# EAGLE design TiltyDuo (EAGLE 6.4)
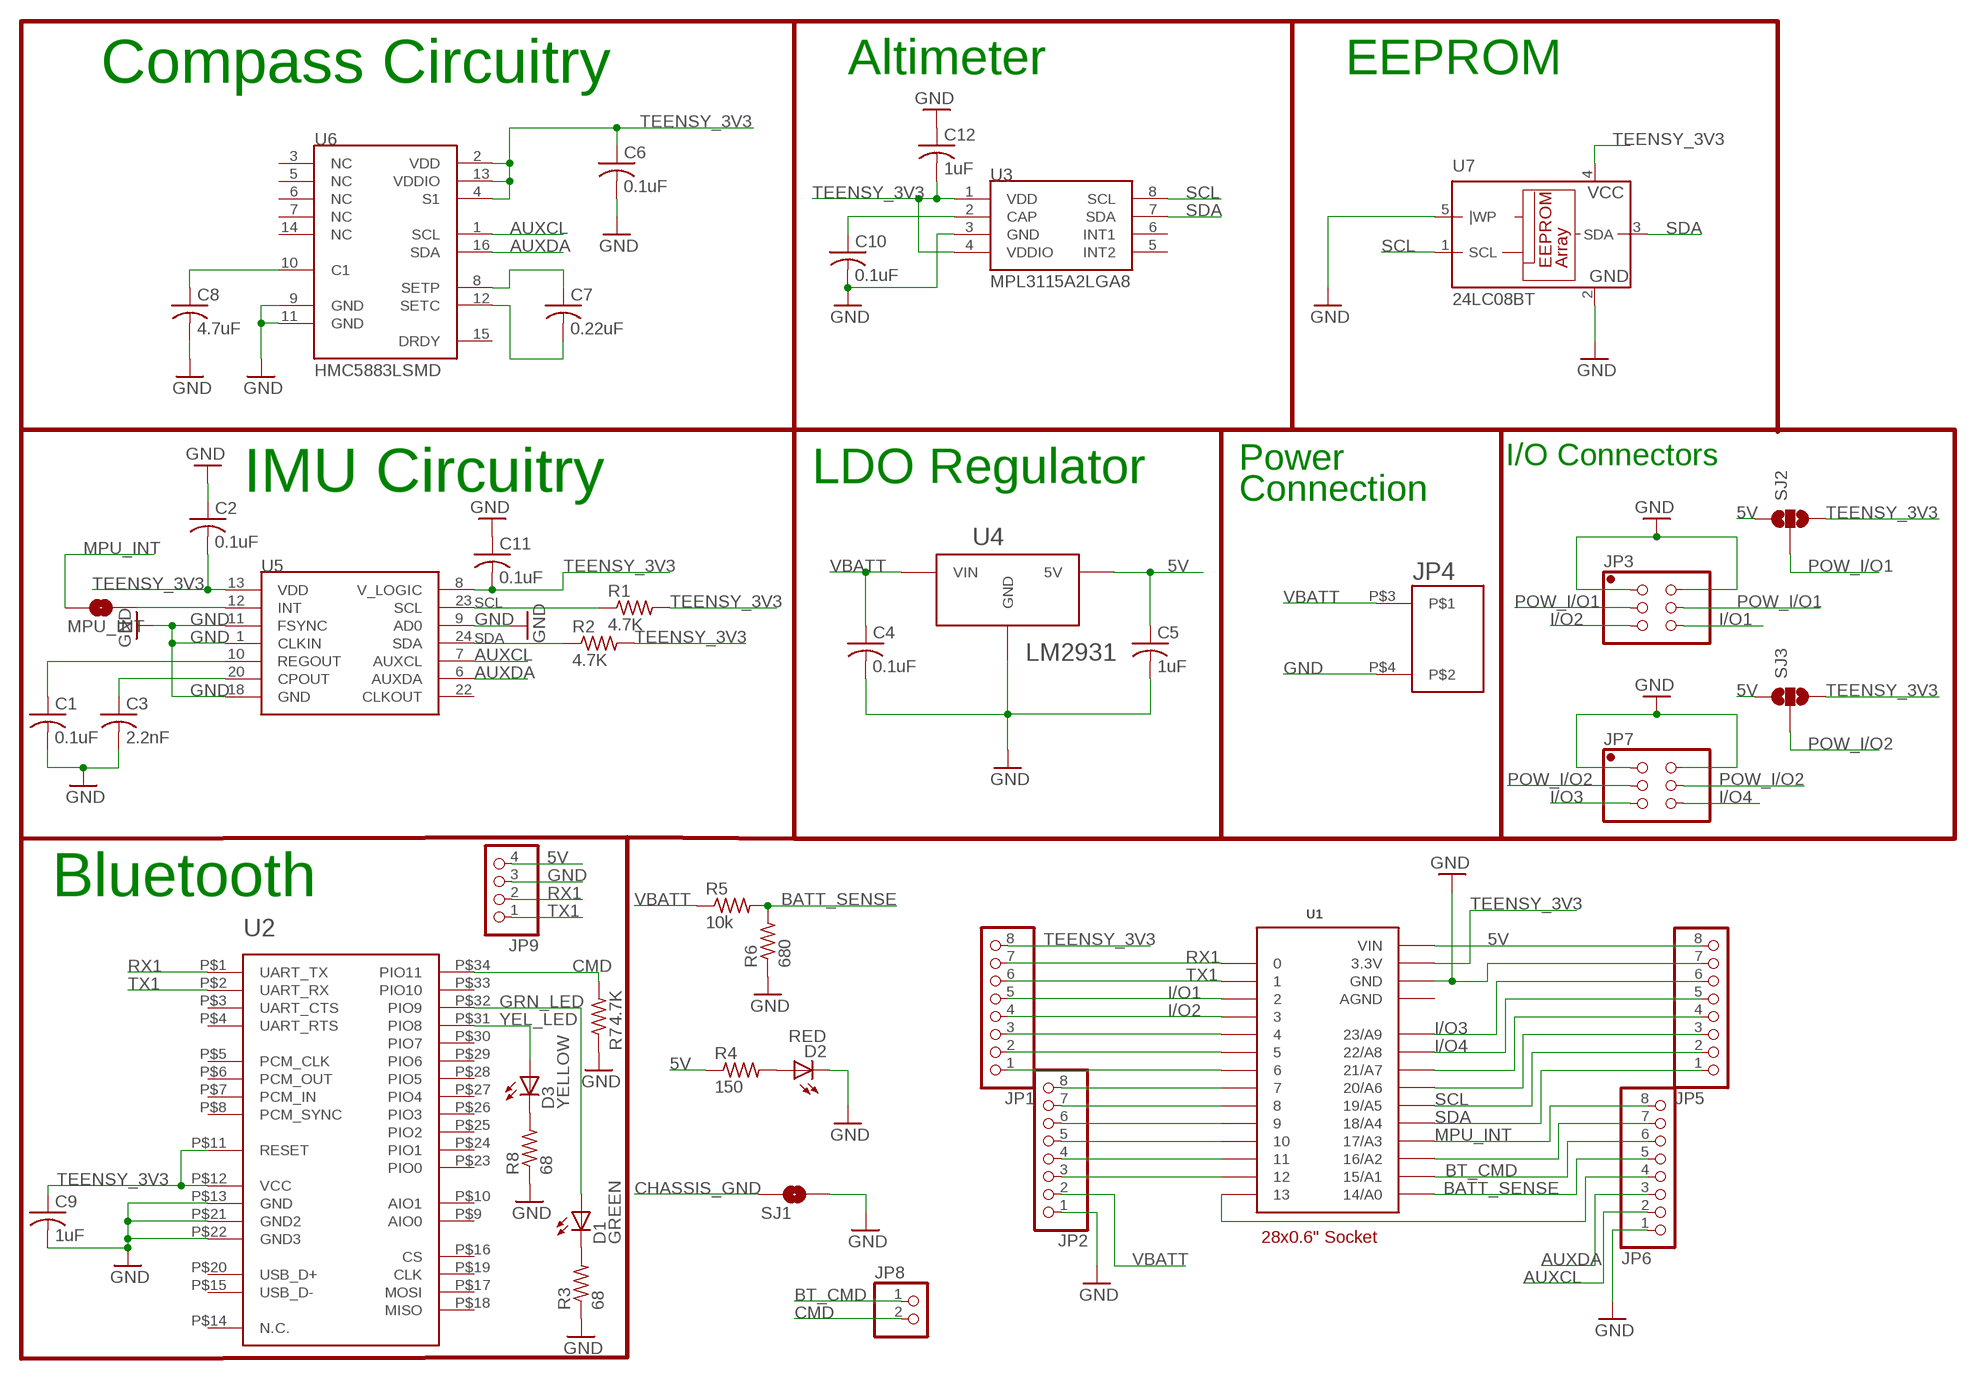
[diagram p0: schematic, sheet 1]

## Parts
C1  0.1uF  C-USC0603  [C0603]
C2  0.1uF  C-USC0603  [C0603]
C3  2.2nF  C-USC0603  [C0603]
C4  0.1uF  C-USC0603  [C0603]
C5  1uF  C-USC0603  [C0603]
C6  0.1uF  C-USC0603  [C0603]
C7  0.22uF  C-USC0603  [C0603]
C8  4.7uF  C-USC0603  [C0603]
C9  1uF  C-USC0603  [C0603]
C10  0.1uF  C-USC0603  [C0603]
C11  0.1uF  C-USC0603  [C0603]
C12  1uF  C-USC0603  [C0603]
D1  GREEN  LED-GREENLED-0805_NO_SILK  [LED-0805]
D2  RED  LED-GREENLED-0805_NO_SILK  [LED-0805]
D3  YELLOW  LED-GREENLED-0805_NO_SILK  [LED-0805]
JP1  PINHD-1X81X08_NO_SILK  [1X08_NO_SS]
JP2  PINHD-1X81X08_NO_SILK  [1X08_NO_SS]
JP3  PINHD-2X32X03_NO_SILK  [2X03_NO_SS]
JP4  2-POS_SMD_TERM_BLOCK  [2-POS_SMD_TERMINAL_BLOCK]
JP5  PINHD-1X81X08_NO_SILK  [1X08_NO_SS]
JP6  PINHD-1X81X08_NO_SILK  [1X08_NO_SS]
JP7  PINHD-2X32X03_NO_SILK  [2X03_NO_SS]
JP8  PINHD-1X21X02_NO_SILK  [1X02_NO_SS]
JP9  PINHD-1X4  [1X04]
MPU_INT  SOLDERJUMPERNO  [SJ_2S-NO]
R1  4.7K  R-US_R0402  [R0402]
R2  4.7K  R-US_R0402  [R0402]
R3  68  R-US_R0603  [R0603]
R4  150  R-US_R0603  [R0603]
R5  10k  R-US_R0603  [R0603]
R6  680  R-US_R0603  [R0603]
R7  4.7K  R-US_R0603  [R0603]
R8  68  R-US_R0603  [R0603]
SJ1  SOLDERJUMPERNO  [SJ_2S-NO]
SJ2  SOLDERJUMPER_2WAYS  [SJ_3]
SJ3  SOLDERJUMPER_2WAYS  [SJ_3]
U1  TEENSY_3.0_OUTER-PINS28-DIP_SOCKET  [28-DIP]
U2  HC-09_BREAKOUT  [HC-09_BREAKOUT]
U3  MPL3115A2LGA8  [LGA8]
U4  LM2931  [TO263]
U5  MPU-6050  [QFN-24]
U6  HMC5883LSMD  [16LPCC]
U7  24LC08BT  [SOT23-5L]

## Nets
5V: C5.1 JP5.8 JP9.4 R4.1 SJ2.1 SJ3.1 U1.P$15(VIN) U4.P$3(5V)
AUXCL [I/O]: JP6.2 U5.7(AUXCL) U6.1(SCL)
AUXDA [I/O]: JP6.3 U5.6(AUXDA) U6.16(SDA)
BATT_SENSE: JP6.5 R5.2 R6.2 U1.P$27(14/A0)
BT_CMD: JP6.6 JP8.1 U1.P$26(15/A1)
CHASSIS_GND: SJ1.1
CMD: JP8.2 R7.2 U2.P$34(PIO11)
GND: C1.2 C2.1 C3.2 C4.2 C5.2 C6.2 C8.2 C9.2 C10.2 C11.1 C12.1 D2.2(C) JP2.1 JP3.1 JP3.2 JP4.P$4 JP5.7 JP6.1 JP7.1 JP7.2 JP9.3 R3.1 R6.1 R7.1 R8.1 SJ1.2 U1.P$1(GND) U2.P$13(GND) U2.P$21(GND2) U2.P$22(GND3) U3.3(GND) U4.P$1(GND) U5.1(CLKIN) U5.9(AD0) U5.11(FSYNC) U5.18(GND) U6.9(GND) U6.11(GND) U7.2(GND) U7.5(|WP)
GRN_LED: D1.1(A) U2.P$32(PIO9)
I/O1: JP1.5 JP3.6 U1.P$4
I/O2: JP1.4 JP3.5 U1.P$5
I/O3: JP5.6 JP7.5 U1.P$18(23/A9)
I/O4: JP5.5 JP7.6 U1.P$19(22/A8)
MPU_INT: JP6.8 MPU_INT.1 U1.P$24(17/A3)
N$1: C1.1 U5.10(REGOUT)
N$2: C3.1 U5.20(CPOUT)
N$3: D1.2(C) R3.2
N$5: C7.1 U6.8(SETP)
N$6: C7.2 U6.12(SETC)
N$7: JP1.3 U1.P$6
N$8: JP1.2 U1.P$7
N$9: JP1.1 U1.P$8
N$10: JP6.4 U1.P$28
N$11: C8.1 U6.10(C1)
N$12: JP2.6 U1.P$11
N$13: JP2.5 U1.P$12
N$14: JP2.4 U1.P$13
N$15: JP2.3 U1.P$14
N$16: MPU_INT.2 U5.12(INT)
N$17: D2.1(A) R4.2
N$18: JP5.4 U1.P$20(21/A7)
N$19: JP5.3 U1.P$21(20/A6)
N$21: C10.1 U3.2(CAP)
N$23: JP6.7 U1.P$25(16/A2)
N$24: D3.2(C) R8.2
POW_I/O1: JP3.3 JP3.4 SJ2.2
POW_I/O2: JP7.3 JP7.4 SJ3.2
RX1: JP1.7 JP9.2 U1.P$2 U2.P$1(UART_TX)
RX3: JP2.8 U1.P$9
SCL [I/O]: JP5.2 R1.1 U1.P$22(19/A5) U3.8(SCL) U5.23(SCL) U7.1(SCL)
SDA [I/O]: JP5.1 R2.1 U1.P$23(18/A4) U3.7(SDA) U5.24(SDA) U7.3(SDA)
TEENSY_3V3 [3.3V]: C2.2 C6.1 C9.1 C11.2 C12.2 JP1.8 R1.2 R2.2 SJ2.3 SJ3.3 U1.P$17(3.3V) U2.P$11(RESET) U2.P$12(VCC) U3.1(VDD) U3.4(VDDIO) U5.8(V_LOGIC) U5.13(VDD) U6.2(VDD) U6.4(S1) U6.13(VDDIO) U7.4(VCC)
TX1: JP1.6 JP9.1 U1.P$3 U2.P$2(UART_RX)
TX3: JP2.7 U1.P$10
VBATT: C4.1 JP2.2 JP4.P$3 R5.1 U4.P$2(VIN)
YEL_LED: D3.1(A) U2.P$31(PIO8)
Unconnected: U2.P$3(UART_CTS) U2.P$4(UART_RTS) U2.P$5(PCM_CLK) U2.P$6(PCM_OUT) U2.P$7(PCM_IN) U2.P$8(PCM_SYNC) U2.P$9(AIO0) U2.P$10(AIO1) U2.P$14(N.C.) U2.P$15(USB_D-) U2.P$16(CS) U2.P$17(MOSI) U2.P$18(MISO) U2.P$19(CLK) U2.P$20(USB_D+) U2.P$23(PIO0) U2.P$24(PIO1) U2.P$25(PIO2) U2.P$26(PIO3) U2.P$27(PIO4) U2.P$28(PIO5) U2.P$29(PIO6) U2.P$30(PIO7) U2.P$33(PIO10) U3.5(INT2) U3.6(INT1) U5.22(CLKOUT) U6.3(NC) U6.5(NC) U6.6(NC) U6.7(NC) U6.14(NC) U6.15(DRDY)

## Notes on the sheet
- Compass Circuitry | Altimeter | EEPROM
- Power | I/O Connectors
- IMU Circuitry | LDO Regulator
- Connection
- Bluetooth
- 28x0.6" Socket

## Power pins joined to a net without a drawn wire
AGND: U1.P$16(AGND)

## Library data of the parts
C1 C6 C9 C10 = resistor:C-US: CAPACITOR, American symbol; RATED_VOLTAGE: 2
C2 C4 C5 C11 C12 = resistor:C-US: CAPACITOR, American symbol
C3 = resistor:C-US: CAPACITOR, American symbol; RATED_VOLTAGE: 50
C7 C8 = resistor:C-US: CAPACITOR, American symbol; ESR: <200mOhms
D1-D3 = SparkFun-LED:LED-GREEN: Various green LEDs 0603- DIO-00821 LARGE- DIO-00862 LILYPAD- DIO-09910
JP1 JP2 JP5 JP6 = pinhead:PINHD-1X8: PIN HEADER
JP3 JP7 = pinhead:PINHD-2X3: PIN HEADER
JP4 = My Parts:2-POS_SMD_TERM_BLOCK
JP8 = pinhead:PINHD-1X2: PIN HEADER
JP9 = pinhead:PINHD-1X4: PIN HEADER
MPU_INT SJ1 = SparkFun-Passives:SOLDERJUMPER: Solder Jumper Standard SMD solder jumper. Used to automate production. Two varients : Normally Open and Normally Closed are the same, but have different paste layers. NC will have a large amount of paste and should jumper during reflow.
R1-R8 = resistor:R-US_: RESISTOR, American symbol
SJ2 SJ3 = SparkFun-Passives:SOLDERJUMPER_2WAY: Solder Jumper 2 way solder jumper
U1 = My Parts:TEENSY_3.0_OUTER-PINS; COST: 0.28
U2 = csr:HC-09_BREAKOUT
U3 = SparkFun-Sensors:MPL3115A2: Altimeter/Pressure Sensor, I2C, 1.95V-3.6V supply, 50 to 110kPa
U4 = on-semiconductor:LM2931; COST: 0.53
U5 = SparkFun-Sensors:MPU-6050: MPU-6000 - I2C address is 0x68 with AD0 low and 0x69 with AD0 high.
U6 = SparkFun:HMC5883L: 3 Axis Digital Compass IC
U7 = microchip:24LC08BT

## Board
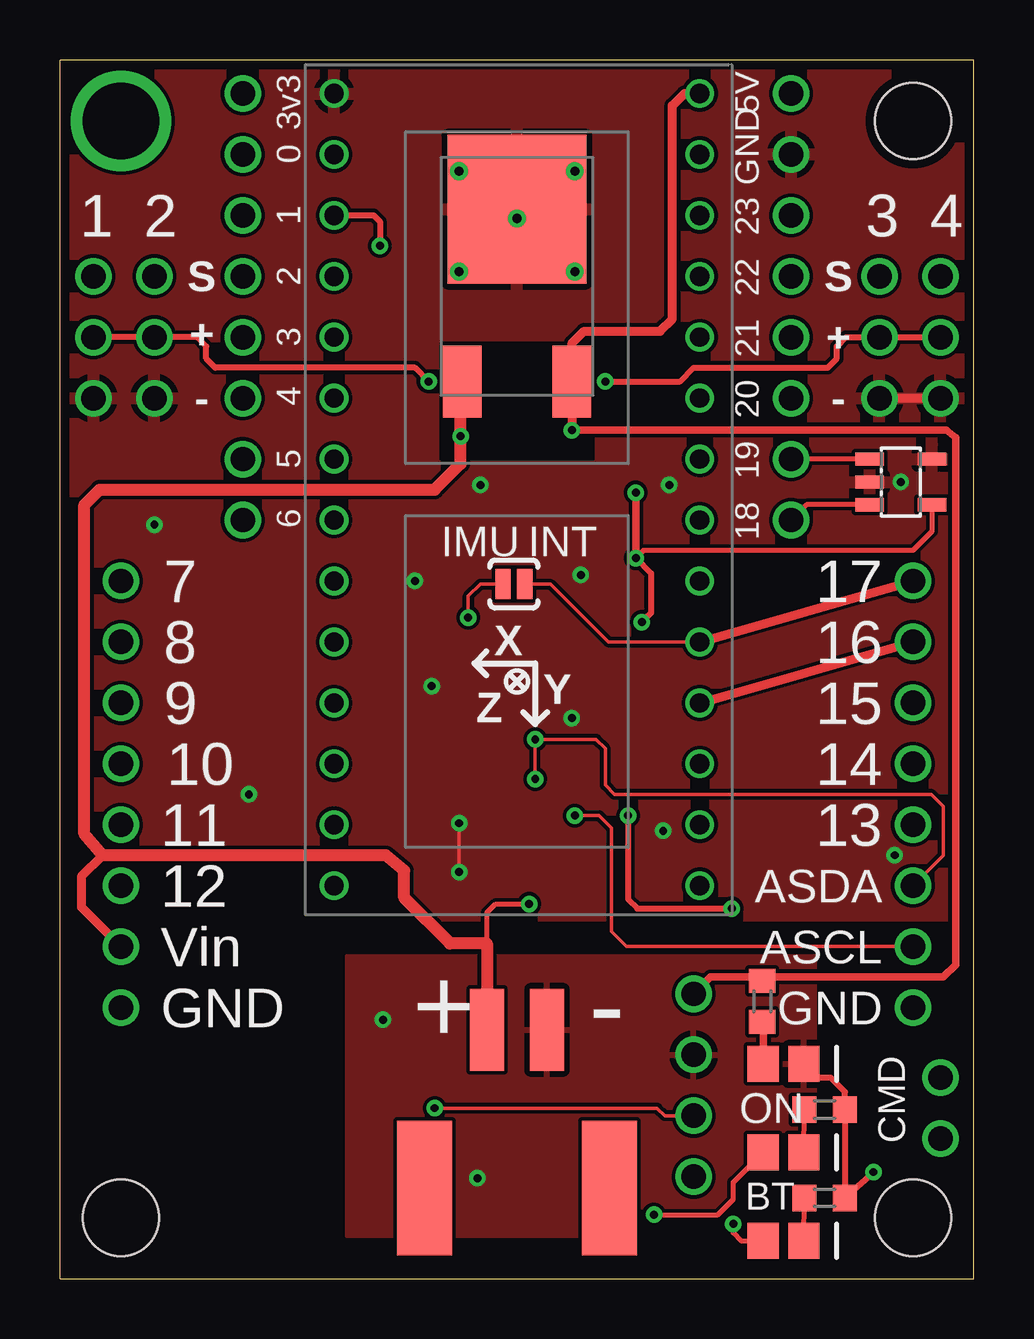
[diagram p1: board, top side]
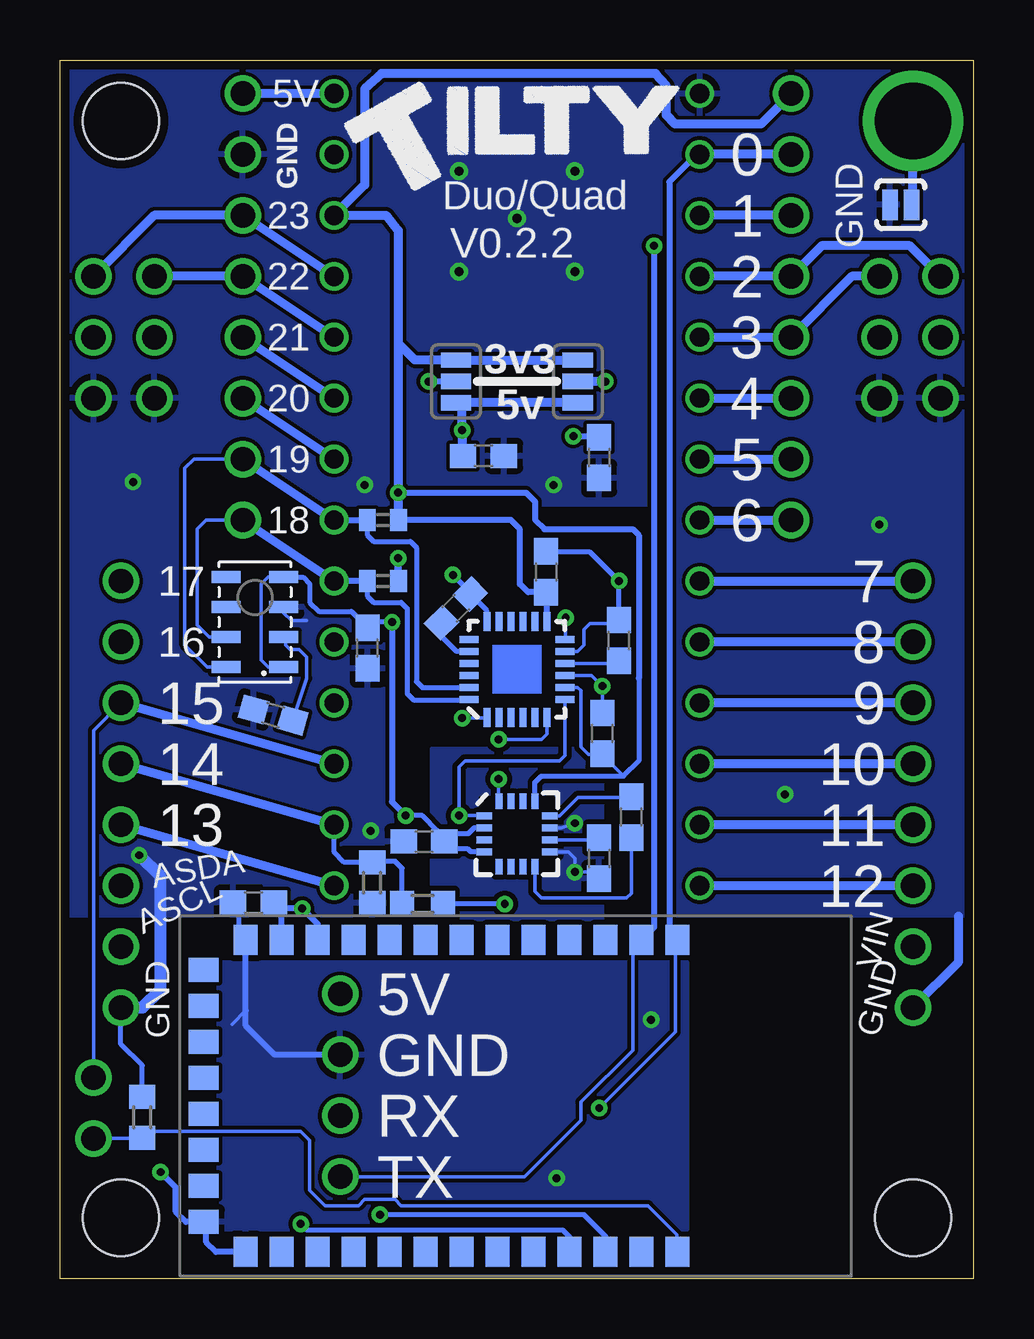
[diagram p2: board, bottom side, seen from below]

Size 38.1 x 50.8 mm. Coordinates in mm from the lower left corner, seen from the top.
Outline: 0,0 38.1,0 38.1,50.8 0,50.8 0,0
Copper layers (1*16): Top 0.0356mm / dielectric 1.5011mm / Bottom 0.0356mm
Design rules "LaenPCBOrder": minimum track width 6mil, minimum drill 13mil, track to track 6mil, track to pad 6mil, pad to pad 6mil, via to via 6mil, smd to smd 6mil, copper to edge 15mil, drill to drill 6mil, minimum pad ring 7mil, minimum via ring 7mil, stop-mask expansion 4mil, vias tented up to drill 0mil, thermal gap 10mil
Holes 3.17 mm at 35.56,48.26 35.56,2.54 2.54,2.54

### Footprints (pad centres in the part's own frame; a part is rotated, then mirrored left to right if it is on the bottom)
C0603 = smd 1.1 x 1: 1 -0.85,0; 2 0.85,0
LED-0805 = smd 1.3 x 1.5: 1 -0.85,0; 2 0.85,0
1X08_NO_SS = drill 1.016: 1 -8.89,0; 2 -6.35,0; 3 -3.81,0; 4 -1.27,0; 5 1.27,0; 6 3.81,0; 7 6.35,0; 8 8.89,0
2X03_NO_SS = drill 1.016: 1 -2.54,-1.27; 2 -2.54,1.27; 3 0,-1.27; 4 0,1.27; 5 2.54,-1.27; 6 2.54,1.27
2-POS_SMD_TERMINAL_BLOCK = smd 2.3 x 5.6: P$1 -3.85,-2.325; P$2 3.85,-2.325 | smd 1.4 x 3.4: P$3 -1.25,4.275; P$4 1.25,4.275
1X02_NO_SS = drill 1.016: 1 -1.27,0; 2 1.27,0
1X04 = drill 1.016: 1 -3.81,0; 2 -1.27,0; 3 1.27,0; 4 3.81,0
SJ_2S-NO = smd 0.635 x 1.27: 1 -0.45,0; 2 0.45,0
R0402 = smd 0.7 x 0.9: 1 -0.65,0; 2 0.65,0
R0603 = smd 1 x 1.1: 1 -0.85,0; 2 0.85,0
SJ_3 = smd 0.635 x 1.27: 1 -0.889,0; 2 0,0; 3 0.889,0
28-DIP = drill 0.8: P$1 -7.62,16.51; P$2 -7.62,13.97; P$3 -7.62,11.43; P$4 -7.62,8.89; P$5 -7.62,6.35; P$6 -7.62,3.81; P$7 -7.62,1.27; P$8 -7.62,-1.27; P$9 -7.62,-3.81; P$10 -7.62,-6.35; P$11 -7.62,-8.89; P$12 -7.62,-11.43; P$13 -7.62,-13.97; P$14 -7.62,-16.51; P$15 7.62,16.51; P$16 7.62,13.97; P$17 7.62,11.43; P$18 7.62,8.89; P$19 7.62,6.35; P$20 7.62,3.81; P$21 7.62,1.27; P$22 7.62,-1.27; P$23 7.62,-3.81; P$24 7.62,-6.35; P$25 7.62,-8.89; P$26 7.62,-11.43; P$27 7.62,-13.97; P$28 7.62,-16.51
HC-09_BREAKOUT = smd 1.25 x 1: P$1 -6.5,10.5; P$2 -6.5,9; P$3 -6.5,7.5; P$4 -6.5,6; P$5 -6.5,3; P$6 -6.5,4.5; P$7 -6.5,1.5; P$8 -6.5,0; P$9 -6.5,-1.5; P$10 -6.5,-3; P$11 -6.5,-4.5; P$12 -6.5,-6; P$13 -6.5,-7.5; P$22 6.5,-7.5; P$23 6.5,-6; P$24 6.5,-4.5; P$25 6.5,-3; P$26 6.5,-1.5; P$27 6.5,0; P$28 6.5,1.5; P$29 6.5,3; P$30 6.5,4.5; P$31 6.5,6; P$32 6.5,7.5; P$33 6.5,9; P$34 6.5,10.5 | smd 1 x 1.25: P$14 -5.25,-9.25; P$15 -3.75,-9.25; P$16 -2.25,-9.25; P$17 -0.75,-9.25; P$18 0.75,-9.25; P$19 2.25,-9.25; P$20 3.75,-9.25; P$21 5.25,-9.25
LGA8 = smd 1.2 x 0.5: 1 -1.2,1.875; 2 -1.2,0.625; 3 -1.2,-0.625; 4 -1.2,-1.875; 5 1.2,-1.875; 6 1.2,-0.625; 7 1.2,0.625; 8 1.2,1.875
TO263 = smd 5.791 x 6.198: P$1 0,2.794 | smd 1.6 x 2.997: P$2 -2.286,-4.394; P$3 2.286,-4.394
QFN-24 = smd 0.8 x 0.3: 1 -2,1.25; 2 -2,0.75; 3 -2,0.25; 4 -2,-0.25; 5 -2,-0.75; 6 -2,-1.25; 13 2,-1.25; 14 2,-0.75; 15 2,-0.25; 16 2,0.25; 17 2,0.75; 18 2,1.25 | smd 0.3 x 0.8: 7 -1.25,-2; 8 -0.75,-2; 9 -0.25,-2; 10 0.25,-2; 11 0.75,-2; 12 1.25,-2; 19 1.25,2; 20 0.75,2; 21 0.25,2; 22 -0.25,2; 23 -0.75,2; 24 -1.25,2
16LPCC = smd 0.65 x 0.28: 1 -1.37,0.75; 2 -1.37,0.25; 3 -1.37,-0.25; 4 -1.37,-0.75; 9 1.37,-0.75; 10 1.37,-0.25; 11 1.37,0.25; 12 1.37,0.75 | smd 0.28 x 0.65: 5 -0.75,-1.37; 6 -0.25,-1.37; 7 0.25,-1.37; 8 0.75,-1.37; 13 0.75,1.37; 14 0.25,1.37; 15 -0.25,1.37; 16 -0.75,1.37
SOT23-5L = smd 0.55 x 1.2: 1 -0.95,-1.3; 2 0,-1.3; 3 0.95,-1.3; 4 0.95,1.3; 5 -0.95,1.3

### Placement (x,y rotation side)
C1  14.8,26.61 90 bottom
C2  17.84,29.46 270 bottom
C3  21.59,27.94 45 bottom
C4  15.62,34.23 270 bottom
C5  20.45,34.29 0 bottom
C6  22.92,18.22 180 bottom
C7  14.29,19.24 90 bottom
C8  15.62,17.53 270 bottom
C9  30.04,15.68 180 bottom
C10  29.21,23.5 164.1 bottom
C11  15.49,22.73 270 bottom
C12  25.27,26.29 90 bottom
D1  30.16,5.27 0 top
D2  30.16,8.95 0 top
D3  30.16,1.59 0 top
JP1  7.62,40.51 90 top
JP2  2.54,20.19 90 top
JP3  2.67,39.24 90 top
JP4  19.05,6.1 0 top
JP5  30.48,40.51 90 top
JP6  35.56,20.19 90 top
JP7  35.43,39.24 90 top
JP8  36.7,7.11 270 top
JP9  26.42,8.06 90 top
MPU_INT  18.92,28.96 180 top
R1  24.64,31.62 0 bottom
R2  24.64,29.08 0 bottom
R3  31.88,7.05 180 top
R4  29.27,11.56 270 top
R5  1k  [R0603]  22.99,15.62 180 bottom
R6  68  [R0603]  25.08,16.51 90 bottom
R7  10K  [R0603]  34.67,6.73 270 bottom
R8  31.88,3.37 180 top
SJ1  3.05,44.77 180 bottom
SJ2  16.51,37.4 90 bottom
SJ3  21.59,37.4 90 bottom
U1  19.05,32.89 0 top
U2  22.86,7.62 270 bottom
U3  29.97,27.37 180 bottom
U4  19.05,41.78 0 top
U5  19.05,25.4 90 bottom
U6  19.05,18.54 0 bottom
U7  35.05,33.21 270 top

### Tracks (layer width: path | path; a pad name or v marks a point on that pad's centre or on a via)
5V  (via drill 0.33)
  Top 0.305: 36.83,12.57 37.34,13.08 | 27.11,12.57 JP9.4
  Top 0.318: 37.34,13.08 37.34,35.05 36.96,35.37 v21.34,35.37 | 36.83,12.57 29.27,12.57 | 27.11,12.57 29.27,12.57 | 29.27,12.57 R4.1
  Top 0.381: v21.34,35.37 U4.P$3 21.35,37.4 21.35,39 21.84,39.5 25.02,39.5 25.53,40.01 25.53,48.9 26.04,49.4 U1.P$15
  Bottom 0.381: U1.P$15 JP5.8 | C5.1 21.34,34.33 v21.34,35.37 21.34,36.26 SJ3.1 SJ2.1
AUXCL  (via drill 0.33)
  Top 0.152: v21.46,19.3 22.48,19.3 22.99,18.8 22.99,14.48 23.62,13.84 JP6.2
  Bottom 0.152: U5.7 17.05,21.81 17.27,21.59 21.21,21.59 21.46,21.34 v21.46,19.3 20.43,19.3 U6.1
AUXDA  (via drill 0.33)
  Top 0.152: v19.81,20.83 v19.81,22.48 22.35,22.48 22.73,22.1 22.73,20.57 23.11,20.19 36.32,20.19 36.83,19.68 36.83,17.65 JP6.3
  Bottom 0.152: 17.78,23.38 U5.6 17.8,22.71 18.03,22.48 v19.81,22.48 | v19.81,20.83 19.81,19.92 U6.16
BATT_SENSE
  Bottom 0.203: 24.99,17.46 R6.2 | R6.2 26.25,17.36 26.67,17.78 U1.P$27 | R5.2 23.84,17.11 24.13,17.4 25.04,17.4 R6.2
  Bottom 0.381: U1.P$27 JP6.5
BT_CMD
  Bottom 0.152: JP8.1 36.7,22.86 JP6.6
  Bottom 0.381: U1.P$26 JP6.6
CHASSIS_GND  (via drill 3.17)
  Bottom 0.381: SJ1.1 2.6,44.96 2.54,45.02 v2.54,48.26
CMD
  Bottom 0.152: U2.P$34 12.38,1.1 12.38,1.84 13.59,3.05 23.88,3.05 24.13,3.3 25.4,3.3 25.65,3.05 27.05,3.05 27.69,3.68 27.69,5.78 28.07,6.13 34.46,6.13 R7.2 34.71,5.84 JP8.2 | 12.38,1.14 U2.P$34 | 12,0.64 U2.P$34
GND  (via drill 0.33, 0.38 pad 0.18)
  Top 0.152: v16.64,18.99 v16.64,16.95
  Top 0.254: 30.99,8.38 32.13,8.38 32.73,7.79 R3.1 R8.1 33.93,4.45 v33.91,4.45
  Top 0.381: JP7.2 JP7.1
  Bottom 0.152: U5.9 15.94,25.15 v15.49,24.7 C11.1 | 20.32,23.38 21.32,23.38 v21.34,23.37 | 30.92,10.6 30.35,11.18 | U6.9 16.9,17.79 16.64,17.53 v16.64,16.95 15.39,16.95 C8.2 | U5.11 16.52,26.15 16.26,26.42 16.26,27.05 16,27.3 15.07,27.3 C1.2 | U3.3 28.77,27.76 28.45,27.43 27.81,27.43 | U6.11 17.47,18.79 17.21,18.8 v16.64,18.99
  Bottom 0.203: U2.P$13 30.63,14.39 30.63,15.43 C9.2 | U5.18 20.3,27.85 C3.2 20.99,28.61 v21.72,29.34 | C2.1 17.82,30.29 16,30.29 v14.8,29.08 C1.2 | R7.1 34.67,8.89 35.56,9.78 JP6.1
  Bottom 0.254: 20.32,23.38 U5.1 | U2.P$22 31.6,1.12 32,1.52 32,2.26 U2.P$21 32.85,2.37 33.27,2.79 33.27,3.81 v33.91,4.45 | U2.P$13 | U2.P$13 30.36,13.98 | JP9.3 29.15,9.34 30.35,10.54 30.35,11.18 U2.P$13 | 30.57,14.33 U2.P$13 | 15.47,16.7 C8.2
  Bottom 0.381: JP2.1 0.64,13.21 0.64,15.11
  Bottom 0.508: JP6.1 34.67,11.3 33.91,12.06 33.91,16.76 v34.8,17.65
  other vias: 19.05,44.2 16.64,41.97 21.46,41.97 21.46,46.16 16.64,46.16 7.87,20.19 17.4,4.19 13.46,10.79 25.15,18.67 35.05,33.21 25.4,33.08 3.94,31.43 17.53,33.08
  pour Top (isolate 0.127): 0,50.8 38.1,50.8 38.1,15.11 0,15.11
  pour Bottom: 0,32.26 0,50.8 38.1,50.8 38.1,32.26
  pour Bottom: 0,32.26 13.59,32.26 13.59,15.11 0,15.11
  pour Bottom: 24.13,32.26 37.97,32.26 38.1,15.11 24.26,15.11
  pour Top: 11.94,13.46 31.5,13.46 31.5,1.78 11.94,1.78
  pour Bottom: 11.94,2.03 11.94,13.21 31.5,13.21 31.5,12.57 31.5,2.03
  pour Bottom (isolate 0.203): 15.49,22.1 22.61,22.1 22.61,14.99 15.49,14.99
GRN_LED  (via drill 0.33)
  Top 0.203: v24.77,2.67 27.43,2.67 28.07,3.3 28.07,4.03 D1.1
  Bottom 0.203: U2.P$32 15.36,1.77 16.26,2.67 v24.77,2.67
I/O1
  Bottom 0.381: U1.P$4 JP1.5 6.35,43.05 2.67,43.05 JP3.6
I/O2
  Bottom 0.381: U1.P$5 JP1.4 5.08,41.78 JP3.5
I/O3
  Bottom 0.381: U1.P$18 JP5.6 34.16,44.32 JP7.5
I/O4
  Bottom 0.381: U1.P$19 JP5.5 JP7.6
MPU_INT
  Top 0.152: MPU_INT.1 20.45,28.96 22.86,26.54 U1.P$24
  Top 0.381: U1.P$24 JP6.8
N$1
  Bottom 0.152: U5.10 14.9,25.65 C1.1
N$2
  Bottom 0.203: U5.20 21.58,26.15 22.23,26.8 22.1,27.25 C3.1
N$3
  Top 0.203: D1.2 R3.2
N$4
  cutout Bottom: 17.53,20.07 17.53,17.02 20.57,17.02 20.57,20.07
N$5
  Bottom 0.152: C7.1 14.29,16.07 14.48,15.88 18.03,15.88 18.3,16.14 U6.8
N$6
  Bottom 0.152: U6.12 17.28,19.29 16.51,20.07 14.31,20.07 C7.2
N$7
  Bottom 0.381: U1.P$6 JP1.3
N$8
  Bottom 0.381: U1.P$7 JP1.2
N$9
  Bottom 0.381: U1.P$8 JP1.1
N$10
  Bottom 0.381: U1.P$28 JP6.4
N$11
  Bottom 0.152: U6.10 15.2,18.29 C8.1
N$12
  Bottom 0.381: JP2.6 U1.P$11
N$13
  Bottom 0.381: JP2.5 U1.P$12
N$14
  Bottom 0.381: JP2.4 U1.P$13
N$15
  Bottom 0.381: JP2.3 U1.P$14
N$16  (via drill 0.33)
  Top 0.152: v17.02,27.56 17.02,28.45 17.53,28.96 MPU_INT.2
  Bottom 0.152: v17.02,27.56 17.02,26.68 U5.12
N$17
  Top 0.318: R4.2 29.31,10.71 D2.1
N$18
  Bottom 0.381: U1.P$20 JP5.4
N$19
  Bottom 0.381: U1.P$21 JP5.3
N$20
  cutout Top: 15.88,38.99 22.23,38.99 22.23,34.16 15.88,34.16
N$21
  Bottom 0.152: 28.78,26.86 U3.2 28.7,26.8 28.7,26.42 28.51,26.23 28.13,26.23 27.81,25.91 27.81,25.02 C10.1
N$23
  Top 0.381: U1.P$25 JP6.7
N$24
  Top 0.203: D3.2 R8.2
N$25
  cutout Bottom: 29.72,15.24 29.72,16.38 30.35,16.38 30.35,15.24
N$26
  cutout Bottom: 24.13,16.13 26.29,16.13 26.29,17.97 24.13,17.97
N$28
  cutout Bottom: 28.57,29.84 31.37,29.84 31.37,25.15 28.57,25.15
POW_I/O1  (via drill 0.33)
  Top 0.254: v15.37,37.4 14.8,37.97 6.48,37.97 6.1,38.35 6.1,38.86 5.71,39.24 JP3.3 JP3.4
  Bottom 0.381: v15.37,37.4 SJ2.2
POW_I/O2  (via drill 0.33)
  Top 0.254: v22.73,37.4 25.84,37.4 26.42,37.97 32,37.97 32.38,38.35 32.38,38.86 32.77,39.24 JP7.4 JP7.3
  Bottom 0.254: SJ3.2 v22.73,37.4
RX1  (via drill 0.33)
  Top 0.152: JP9.2 25.21,6.79 24.89,7.11 v15.62,7.11
  Bottom 0.152: 12.38,14.1 U2.P$1 12.45,14.03 12.45,10.29 v15.62,7.11
  Bottom 0.254: U1.P$2 11.56,46.86 12.7,45.72 12.7,14.59 U2.P$1
  Bottom 0.381: JP1.7 U1.P$2
RX3
  Bottom 0.381: U1.P$9 JP2.8
SCL
  Top 0.203: U7.1 JP5.2
  Bottom 0.152: JP5.2 32.51,34.16 32.89,33.78 32.89,26.42 31.97,25.49 U3.8
  Bottom 0.203: R1.1 25.29,31 25.02,30.73 23.5,30.73 23.24,30.48 23.24,24.89 22.99,24.64 21.06,24.64 U5.23
  Bottom 0.254: U1.P$22 R1.1
  Bottom 0.381: U1.P$22 JP5.2
SDA
  Top 0.203: U7.3 31.12,32.26 JP5.1
  Bottom 0.152: JP5.1 32,31.62 32.38,31.24 32.38,27.24 31.89,26.74 U3.7
  Bottom 0.203: R2.1 25.29,28.46 25.02,28.19 23.88,28.19 23.62,27.94 23.62,24.38 23.37,24.13 21.07,24.13 U5.24
  Bottom 0.254: R2.1 U1.P$23
  Bottom 0.381: U1.P$23 JP5.1
TEENSY_3V3  (via drill 0.33)
  Top 0.203: U7.4 36.35,31.14 35.56,30.35 24.32,30.35 v24,30.04
  Top 0.254: v24,30.04 24.64,29.4 24.64,27.75 v24.26,27.37 | v23.69,19.3 23.69,15.81 24.07,15.43 v28,15.43
  Top 0.305: v24,30.04 v24,32.77
  Bottom 0.152: U5.8 16.52,24.65 16.38,24.51 16.38,22.16 16.07,21.84 15.53,21.84 | 15.53,21.84 C11.2 | 15.53,21.84 14.61,20.95 | U3.1 29.43,25.49 29.72,25.78 29.72,28.96 29.43,29.24 U3.4
  Bottom 0.203: U6.4 20.97,17.79 21.08,17.91 21.76,17.91 C6.1 | U6.2 20.83,18.79 21.08,18.54 21.76,18.54 C6.1 | U6.13 18.3,20.69 18.03,20.95 14.61,20.95 13.97,21.59 13.97,25.02 | C6.1 22.29,18.22 22.35,18.29 22.35,18.67 22.99,19.3 v23.69,19.3 | 28.74,29.34 U3.4 27.97,29.24 27.69,28.96 27.69,28.19 27.3,27.81 25.95,27.81 C12.2 25.04,27.37 v24.26,27.37
  Bottom 0.254: U5.13 17.8,28.57 C2.2 18.58,28.61 18.92,28.96 18.92,31.24 19.3,31.62 R1.2 | v24,32.77 18.67,32.77 18.29,32.38 18.29,31.62 17.91,31.24 14.22,31.24 13.97,30.99 13.97,25.02 | U2.P$11 27.36,14.79 v28,15.43 28.93,15.43 C9.1 28.86,15.36 U2.P$12 | v24.26,27.37 24.26,19.88 v23.69,19.3
  Bottom 0.305: v24,30.04 24,29.1 R2.2
  Bottom 0.381: 24,38.99 24,43.69 24.51,44.32 U1.P$17 25.4,45.59 25.4,49.59 24.7,50.23 13.27,50.23 12.83,49.72 12.83,48.51 12.45,48.13 8.89,48.13 JP1.8 | 24,38.99 v24,32.77 24,31.64 R1.2 | 24,38.99 23.3,38.29 SJ3.3 SJ2.3
TX1  (via drill 0.33)
  Top 0.254: U1.P$3 13.08,44.32 13.34,44.07 v13.34,43.05
  Bottom 0.152: JP9.1 18.73,4.25 16.38,6.6 16.38,7.37 14.22,9.53 14.22,13.76 U2.P$2
  Bottom 0.254: v13.34,43.05 13.34,14.64 U2.P$2
  Bottom 0.381: JP1.6 U1.P$3
TX3
  Bottom 0.254: U1.P$10 11.3,26.54
  Bottom 0.381: JP2.7 U1.P$10
VBATT  (via drill 0.33)
  Top 0.203: 17.8,13.97 17.8,15.26 18.16,15.62 v19.56,15.62
  Top 0.381: 1.78,17.65 0.89,16.76 0.89,15.49 JP2.2
  Top 0.508: JP4.P$3 17.8,13.97 16.26,13.97 14.35,15.88 14.35,17.02 13.59,17.65 1.78,17.65 1.02,18.54 1.02,32.26 1.65,32.89 15.62,32.89 16.7,33.97 v16.7,35.12 16.7,37.33 U4.P$2
  Bottom 0.203: v19.56,15.62 R5.1
  Bottom 0.254: v16.7,35.12 15.66,35.12 C4.1
YEL_LED  (via drill 0.33)
  Top 0.203: v28.07,2.29 28.07,1.91 28.38,1.59 D3.1
  Bottom 0.203: U2.P$31 16.86,1.75 17.14,2.03 27.81,2.03 v28.07,2.29

### Text on the board
tNames: 5V | 3v3 | 0 | GND | 1 | 2 | 1 | 3 | 4 | 23 | S | S | 2 | 22 | + | 3 | + | 21 | - | - | 4 | 20 | 5 | 19 | 6 | IMU | INT | 18 | 17 | 7 | 16 | 8 | X | Y | 15 | 9 | Z | 10 | 14 | 11 | 13 | 12 | ASDA | Vin | ASCL | GND | + | - | GND | ON | CMD | BT
bNames: 5V | GND | 0 | GND | Duo/Quad | 1 | 23 | V0.2.2 | 2 | 22 | 3 | 21 | 3v3 | 4 | 20 | 5v | 5 | 19 | 6 | 18 | 7 | 17 | 8 | 16 | 9 | 15 | 10 | 14 | 11 | 13 | ASDA | 12 | ASCL | VIN | 5V | GND | GND | GND | RX | TX